# Altium schematic sheet TEMPLATE_Circuit.SchDoc
size Tabloid; Date: Date; Author: Author 1; Revision: 1; SheetNumber: 8; SheetTotal: 8; Size: 11x17; Sheet_Name: Circuit
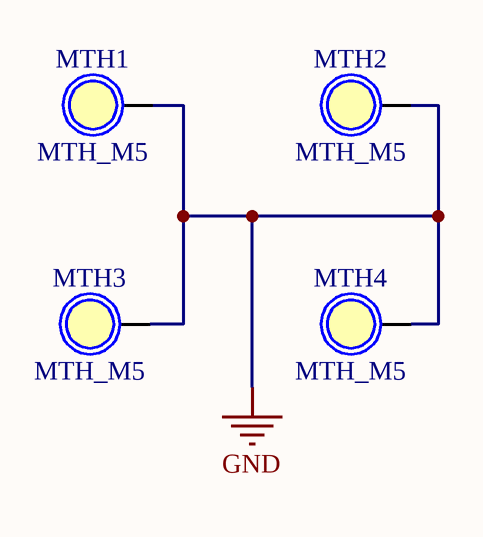
[diagram p0: TEMPLATE_Circuit.SchDoc]

## Parts
MTH1  MTH_M5  [MTH_M5]  (no BOM)
MTH2  MTH_M5  [MTH_M5]  (no BOM)
MTH3  MTH_M5  [MTH_M5]  (no BOM)
MTH4  MTH_M5  [MTH_M5]  (no BOM)

## Nets
GND: MTH1.1 MTH2.1 MTH3.1 MTH4.1

## Notes on the sheet
- Nom de la feuille
- Titre du projet
- Cours associé au projet
- Taille
- Département
- Technologies du
- Révision
- PCB
- .
- SCH
- Date
- génie électrique
- Feuille
- Variant
- de
- Concepteurs

## Library data of the parts
MTH1-MTH4 = CMP-006-000012-1: MTH - MOUNTING HOLE 5MM PLATED - 5MM; Pin Count: 1; HelpURL: *; Manufacturer #1: *; Source: CEGEP_SHERBROOKE_TGE_LIBRARY.SchLib; Power Max: *; Value: *; Assembly Type: NONE; Polarized: *; Component Type: Standard (No BOM); Note: *; Design Item ID: MTH_M5; Part Number #1: *; Package: 5MM